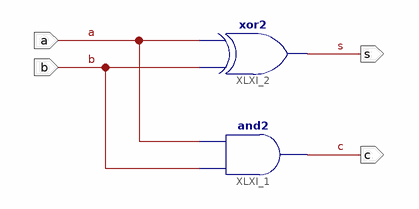
[diagram p0: schematic sheet 1]
// Xilinx ISE schematic half_add.sch (spartan3e) as structural Verilog: 2 symbols, 4 ports
module half_add (
  input  a,
  input  b,
  output s,
  output c
);

  and XLXI_1 (c, b, a);
  xor XLXI_2 (s, b, a);
endmodule
